# EasyEDA Pro project _XLR IN board_2026-02-06.epro

# Schematic Schematic1
Board Name: Board1; Create Date: 2024-03-31; Page Name: P1; Project Name: XLR board; Schematic Name: Schematic1; Update Date: 2024-03-31; Company: EasyEDA.com; Drawn: EasyEDA; Page Size: A4; Part Number: JLCPCB-002; Reviewed: EasyEDA; Version: V0.1
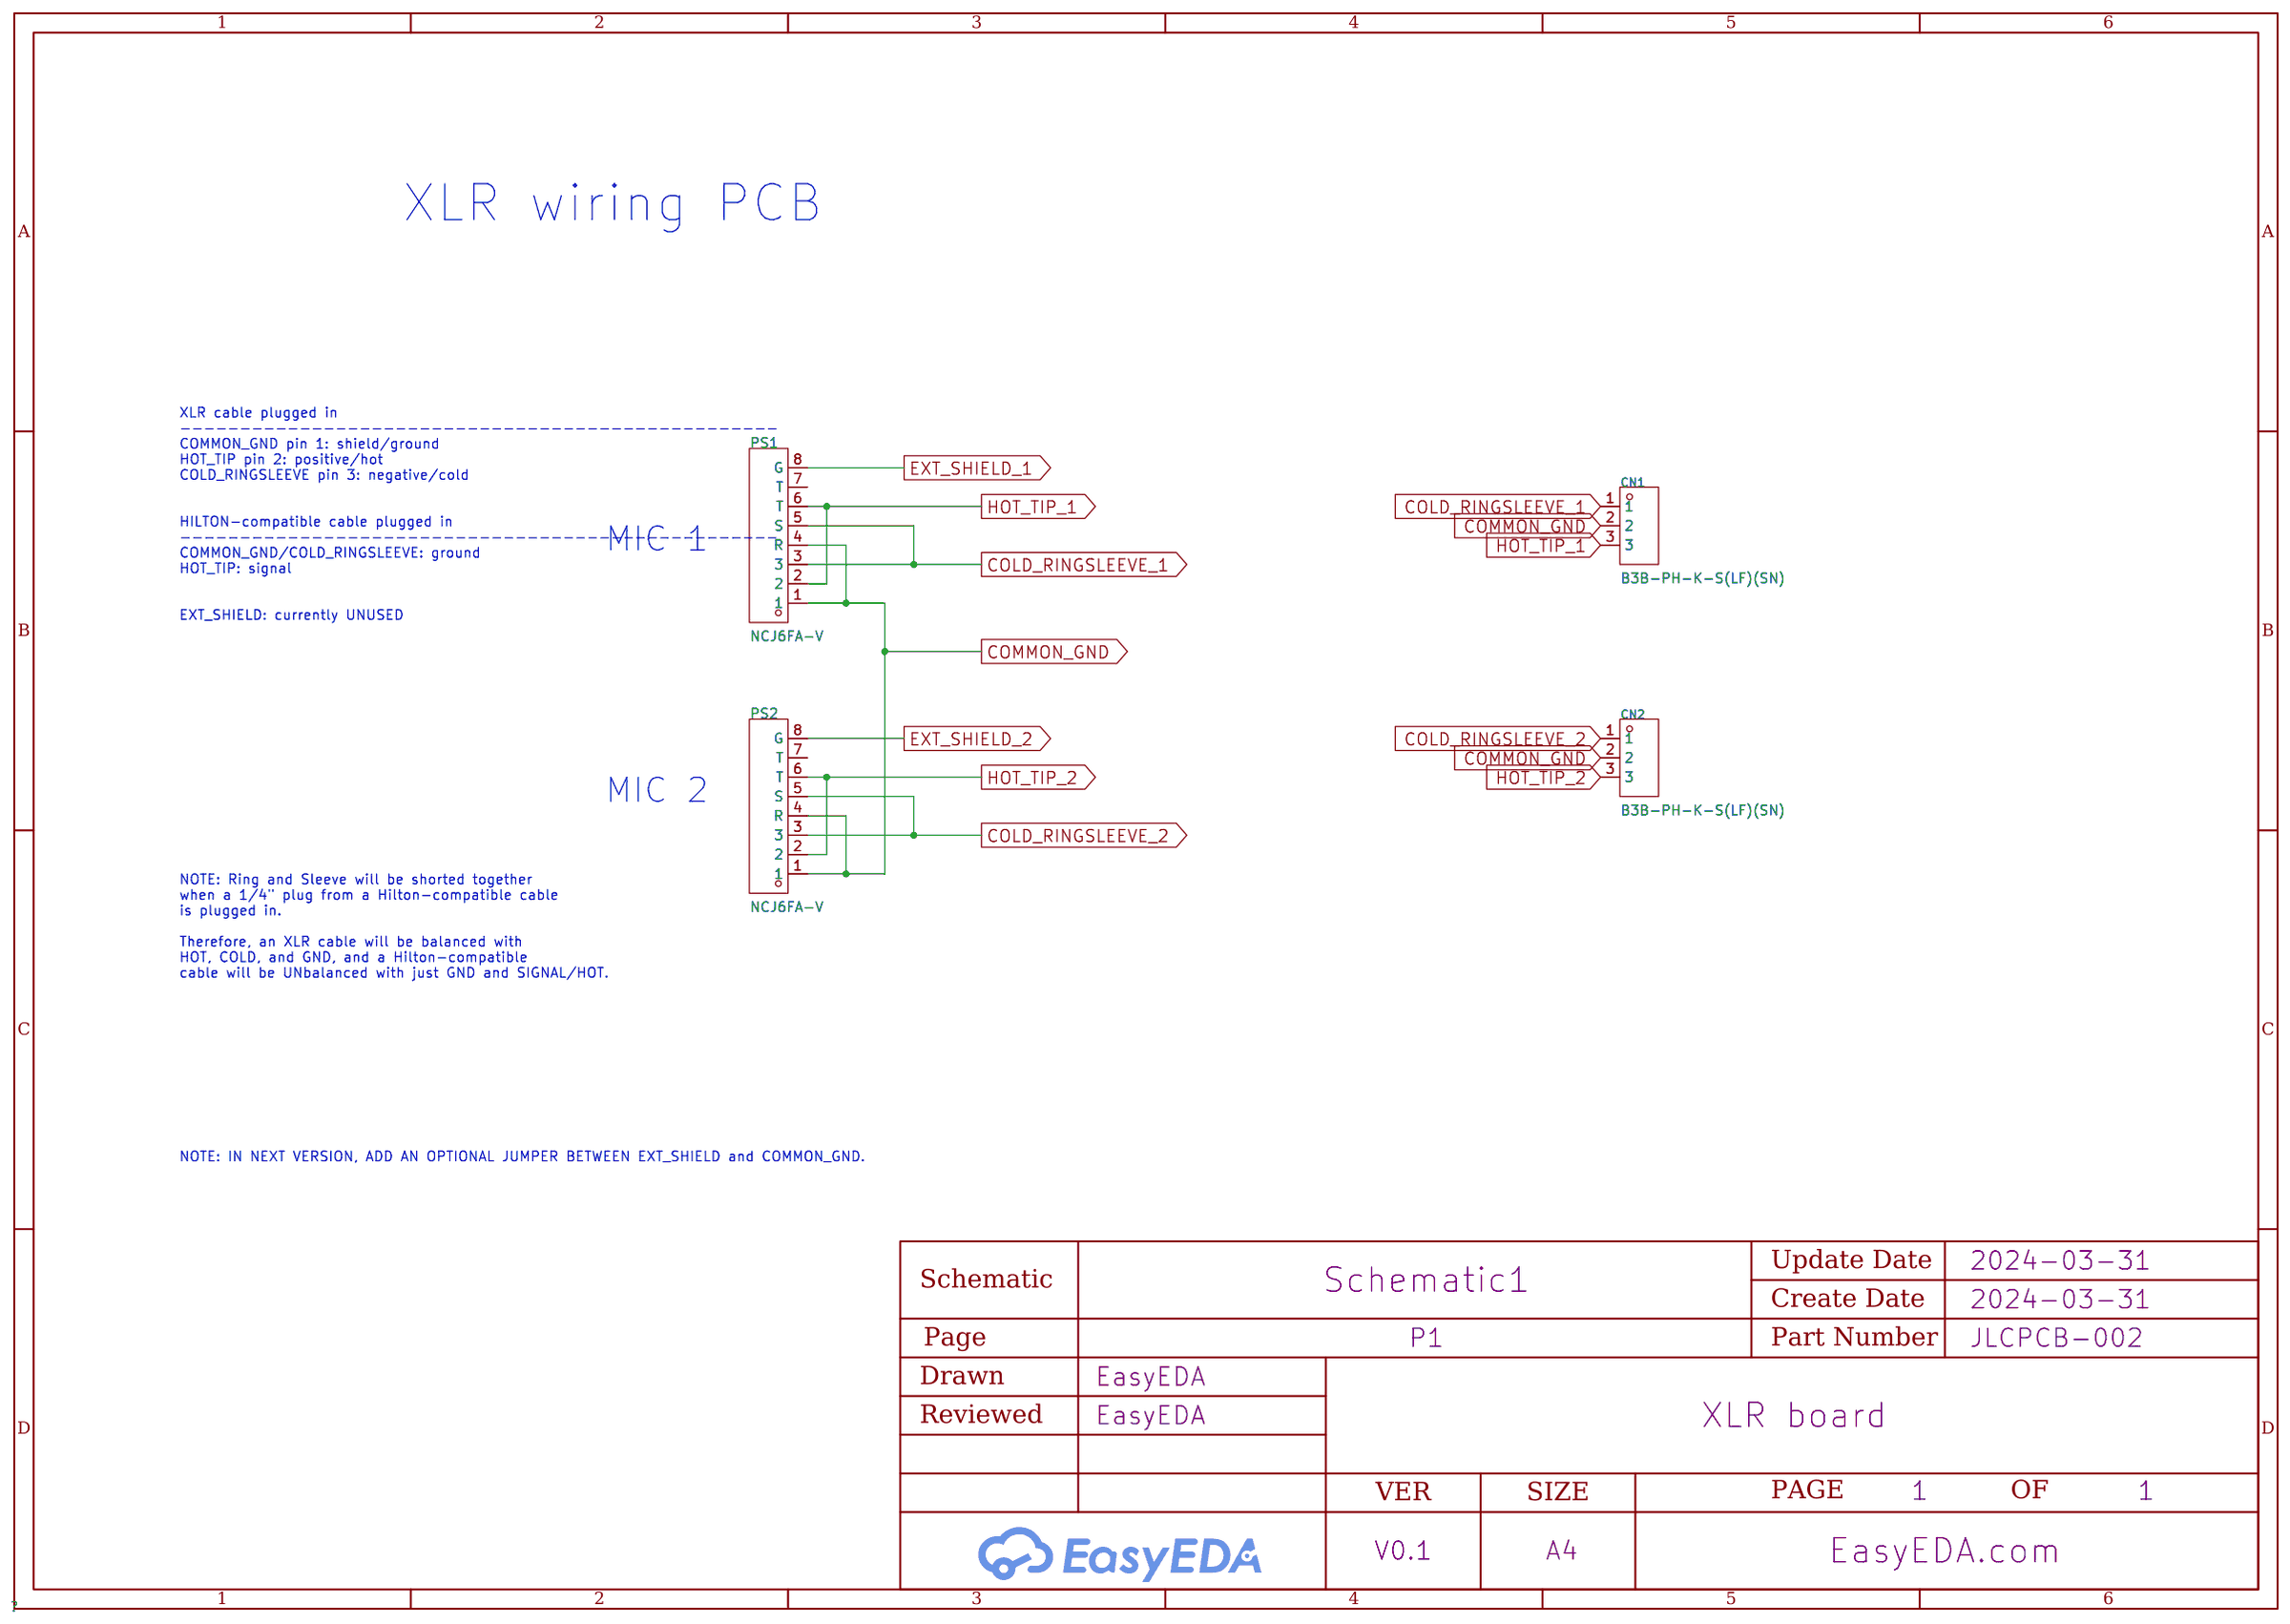
[diagram p0: schematic sheet]

## Parts
CN1  B3B-PH-K-S(LF)(SN)  [CONN-TH_B3B-PH-K-S]  (no BOM)
CN2  B3B-PH-K-S(LF)(SN)  [CONN-TH_B3B-PH-K-S]  (no BOM)
PS1  NCJ6FA-V  [CONN-TH_NCJ6FA-V]
PS2  NCJ6FA-V  [CONN-TH_NCJ6FA-V]

## Library data of the parts
CN1 CN2 = B3B-PH-K-S(LF)(SN): Pins Structure:1x3P Pitch:2mm Mounting Style:- Reference Series:PH Number of Pins:3P Number of Rows:1 Number of PINs Per Row:3 Row Spacing:- Contact Material:Brass; LCSC Part Name: 系列:PH 间距:2mm 1x3P; Supplier Part: C131339; Manufacturer: JST; Supplier Footprint: 插件,P=2mm; JLCPCB Part Class: Extended Part; Datasheet: https://atta.szlcsc.com/upload/public/pdf/source/20171026/C131342_15089839687311058815.pdf; Supplier: LCSC; Pins Structure: 1x3P; Pitch: 2mm; Reference Series: PH; Number of Pins: 3P; Number of Rows: 1; Number of PINs Per Row: 3; Contact Material: Brass
PS1 PS2 = NCJ6FA-V: Connector Type:comboReceptacle Current Rating (Max):- Operating Temperature Range:- Operating Temperature Range:-; Supplier Part: C368485; Manufacturer: NEUTRIK(优曲克); Supplier Footprint: 插件; JLCPCB Part Class: Extended Part; Datasheet: https://atta.szlcsc.com/upload/public/pdf/source/20190222/C368485_C6FAD16DA20D6B054FBED9295A6DC1BE.pdf; Supplier: LCSC; Connector Type: comboReceptacle

## Nets
COLD_RINGSLEEVE_1: CN1.1 PS1.3 PS1.5(S)
COLD_RINGSLEEVE_2: CN2.1 PS2.3 PS2.5(S)
COMMON_GND: CN1.2 CN2.2 PS1.1 PS1.4(R) PS2.1 PS2.4(R)
EXT_SHIELD_1: PS1.8(G)
EXT_SHIELD_2: PS2.8(G)
HOT_TIP_1: CN1.3 PS1.2 PS1.6(T)
HOT_TIP_2: CN2.3 PS2.2 PS2.6(T)

Not connected (* = marked no-connect by the designer): PS1 7(T); PS2 7(T)

## Notes on the sheet
- XLR wiring PCB
- MIC 1
- XLR cable plugged in
  --------------------------------------------------
  COMMON_GND pin 1: shield/ground
  HOT_TIP pin 2: positive/hot
  COLD_RINGSLEEVE pin 3: negative/cold
  HILTON-compatible cable plugged in
  --------------------------------------------------
  COMMON_GND/COLD_RINGSLEEVE: ground
  HOT_TIP: signal
  EXT_SHIELD: currently UNUSED
- MIC 2
- NOTE: Ring and Sleeve will be shorted together
  when a 1/4" plug from a Hilton-compatible cable
  is plugged in.
  Therefore, an XLR cable will be balanced with
  HOT, COLD, and GND, and a Hilton-compatible
  cable will be UNbalanced with just GND and SIGNAL/HOT.
- NOTE: IN NEXT VERSION, ADD AN OPTIONAL JUMPER BETWEEN EXT_SHIELD and COMMON_GND.

# Board PCB1
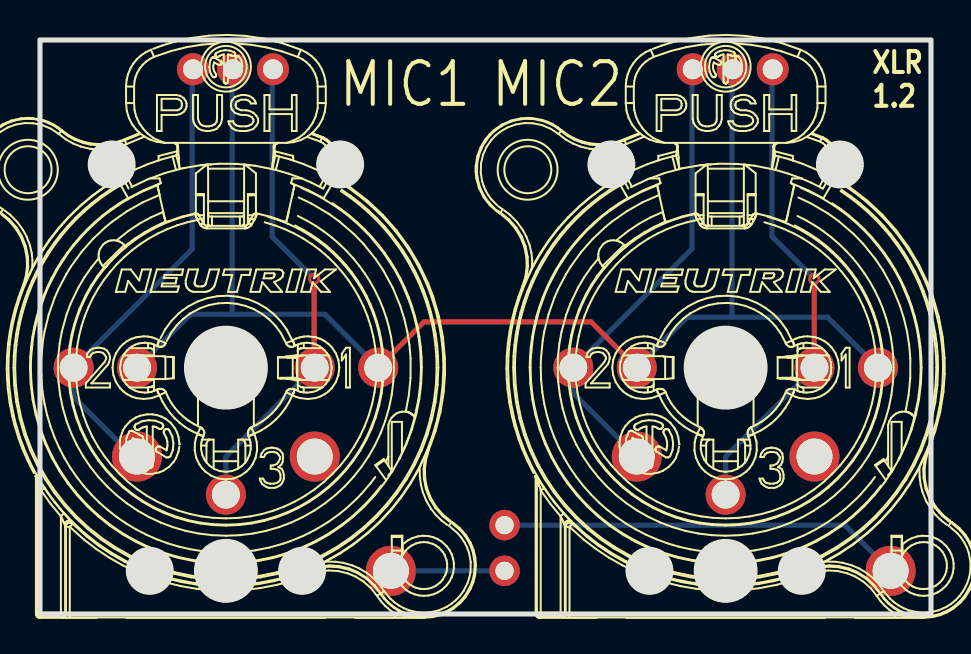
[diagram p1: board, top side]
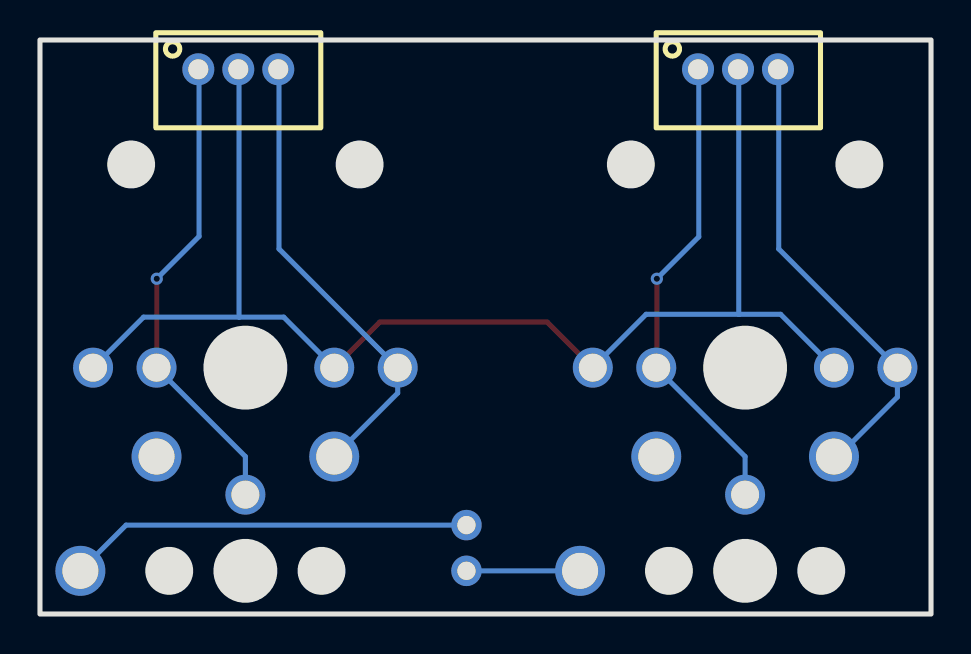
[diagram p2: board, bottom side, seen from below]

Outline 44.58 x 28.7 mm; copper layers: Top Layer, Bottom Layer. Coordinates in mm from the lower left corner of the outline.
Outline path: rectangle 0,28.7 44.58,0
Stack: Top Layer 0.035mm / Dielectric1 1.51mm FR4 er 4.5 / Bottom Layer 0.035mm

## Design rules (mm)
template: JLCPCB Capability(Two Layers Board)
spacing copperThickness1oz (default): track to track 0.102, other pairs 0.152 to 0.3
spacing copperThickness2oz: track to track 0.203, other pairs 0.152 to 0.3
track width copperThickness1oz (default): min 0.127, default 0.254, max 2.54
track width copperThickness2oz: min 0.203, default 0.254, max 2.54
differential pair differentialPair (default): width min 0.127, default 0.254, max 2.54; gap min 0.152, default 0.152
via viaSize (default): diameter min 0.5, default 0.61, max 10; hole min 0.3, default 0.305, max 6.3

## Placement (name value [footprint] x y rotation side)
CN1  B3B-PH-K-S(LF)(SN)  [CONN-TH_B3B-PH-K-S]  9.66 27.24 0 bottom
CN2  B3B-PH-K-S(LF)(SN)  [CONN-TH_B3B-PH-K-S]  34.66 27.24 0 bottom
NOREF  -  [Pad_e163]  23.24 4.44 0 top
NOREF#2  -  [Pad_e136]  23.24 2.16 0 top
PS1  NCJ6FA-V  [CONN-TH_NCJ6FA-V]  9.62 7.24 0 top
PS2  NCJ6FA-V  [CONN-TH_NCJ6FA-V]  34.62 7.24 0 top

## Footprints (pads in the part's own frame, mm; a bottom-side part is the same pattern mirrored in y, then rotated)
CONN-TH_B3B-PH-K-S
  round 1.6 hole 1: 1(2,0) 2(0,0) 3(-2,0)
CONN-TH_NCJ6FA-V
  round 2 hole 1.4: 1(7.303,5.08) 2(-7.938,5.08) 3(-0.318,-1.27) 4(-4.763,5.08) 5(4.128,5.08)
  round 2.5 hole 1.8: 6(-4.763,0.635) 7(4.128,0.635) 8(7.938,-5.08)
Pad_e136
  round 1.524 hole 0.914: 9(0,0)
Pad_e163
  round 1.524 hole 0.914: 10(0,0)

## Nets
COLD_RINGSLEEVE_1: CN1.1 PS1.3 PS1.5
COLD_RINGSLEEVE_2: CN2.1 PS2.3 PS2.5
COMMON_GND: CN1.2 CN2.2 PS1.1 PS1.4 PS2.1 PS2.4
EXT_SHIELD_1: NOREF#2.9 PS1.8
EXT_SHIELD_2: NOREF.10 PS2.8
HOT_TIP_1: CN1.3 PS1.2 PS1.6
HOT_TIP_2: CN2.3 PS2.2 PS2.6

Pads without a net: PS1 7; PS2 7

## Via types
v1: diameter 0.61, hole 0.305, Top Layer to Bottom Layer, 2 vias

## Routing (per net, layer and track width the routed paths; a pad name or vN(x,y) marks a point on that pad's centre or on a via; arc(x,y) is an arc through that point)
COLD_RINGSLEEVE_1: length 24
  Top Layer w0.254: PS1.5 13.72,12.35 v1(13.72,16.76)
  Bottom Layer w0.254: PS1.5 9.3,7.87 PS1.3 ; 11.62,27.24 11.62,18.86 v1(13.72,16.76)
COLD_RINGSLEEVE_2: length 24
  Top Layer w0.254: PS2.5 38.74,12.33 v1(38.74,16.76)
  Bottom Layer w0.254: PS2.5 34.3,7.87 PS2.3 ; 36.62,27.24 36.62,18.88 v1(38.74,16.76)
COMMON_GND: length 67.9
  Top Layer w0.254: PS2.4 27.57,14.61 19.21,14.61 PS1.1
  Bottom Layer w0.254: PS1.1 14.25,14.99 9.62,14.99 ; 34.61,14.84 39.4,14.84 PS2.1 ; 34.61,14.84 32.38,14.84 PS2.4 ; 34.61,14.84 34.62,14.85 34.62,27.24 ; 9.62,14.99 9.62,27.24 ; 9.62,14.99 7.52,14.99 PS1.4
EXT_SHIELD_1: length 5.7
  Bottom Layer w0.254: PS1.8 23.24,2.16
EXT_SHIELD_2: length 20.3
  Bottom Layer w0.254: NOREF.10 40.27,4.44 PS2.8
HOT_TIP_1: length 23.1
  Bottom Layer w0.254: 4.66,7.87 1.68,10.85 PS1.2 7.62,18.26 7.62,27.24
HOT_TIP_2: length 23.1
  Bottom Layer w0.254: 32.62,27.24 32.62,18.26 PS2.2 26.68,11.05 PS2.6

## Text on the board
Top Silkscreen Layer: XLR / 1.2 | MIC1 | MIC2
